# Altium schematic sheet led-monitoring.SchDoc
size A4
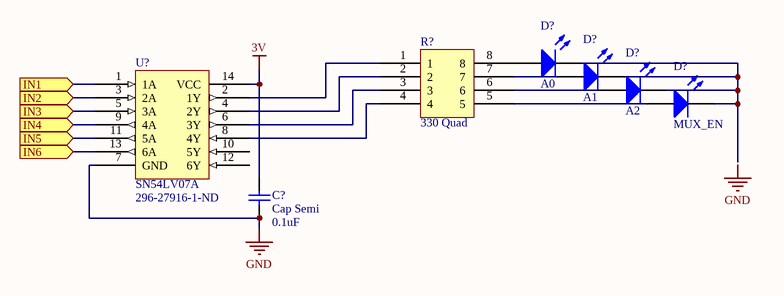
[diagram p0: led-monitoring.SchDoc]

## Parts
(Parts that share a designator on the sheet are numbered #1, #2 ... from top to bottom, then left to right.)
C?  Cap Semi  value 0.1uF  [C1206]
D?#1  A0  [3.2X1.6X1.1]
D?#2  A1  [3.2X1.6X1.1]
D?#3  A2  [3.2X1.6X1.1]
D?#4  MUX_EN  [3.2X1.6X1.1]
R?  330 Quad
U?  SN54LV07A  Supplier Part Number: 296-27916-1-ND  [SOP65P640X120-14N]

## Ports
IN1 (in), IN2 (in), IN3 (in), IN4 (in), IN5 (in), IN6 (in)

## Nets
3V: C?.2 U?.14(VCC)
GND: C?.1 U?.7(GND)
IN1: U?.1(1A) ; port IN1
IN2: U?.3(2A) ; port IN2
IN3: U?.5(3A) ; port IN3
IN4: U?.9(4A) ; port IN4
IN5: U?.11(5A) ; port IN5
IN6: U?.13(6A) ; port IN6
NetD?#1_1: D?#1.1(A) R?.8
NetD?#1_2: D?#1.2(K) D?#2.2(K) D?#3.2(K) D?#4.2(K)
NetD?#2_1: D?#2.1(A) R?.7
NetD?#3_1: D?#3.1(A) R?.6
NetD?#4_1: D?#4.1(A) R?.5
NetR?_1: R?.1 U?.2(1Y)
NetR?_2: R?.2 U?.4(2Y)
NetR?_3: R?.3 U?.6(3Y)
NetR?_4: R?.4 U?.8(4Y)

Not connected (* = marked no-connect by the designer): U? 10(5Y) 12(6Y)

## Notes on the sheet
- Labels drawn without touching a wire or pin: GND

## Library data of the parts
C? = Cap Semi: Capacitor (Semiconductor SIM Model); Published: 8-Jun-2000; LatestRevisionDate: 29-May-2009; LatestRevisionNote: IPC-7351 Footprint Added.; PackageReference: C1206; Publisher: Altium Limited; PackageDescription: Chip Capacitor
D?#1-D?#4 = LED2: Typical RED, GREEN, YELLOW, AMBER GaAs LED; Published: 8-Jun-2000; LatestRevisionDate: 17-Jul-2002; LatestRevisionNote: Re-released for DXP Platform.; PackageVersion: Feb-2002; PackageReference: 3.2X1.6X1.1; Publisher: Altium Limited; PackageDescription: SM LED; 2 Flat Leads
R? = Res Quad Pack: Quad pack resistor
U? = SN54LV07A: Six element 1-bit non-inverting open-drain buffer.; Supplier: Digi-Key